# Altium schematic sheet Microcontroler.SchDoc: Soldeerstation
size A4; SheetNumber: 2; SheetTotal: 5
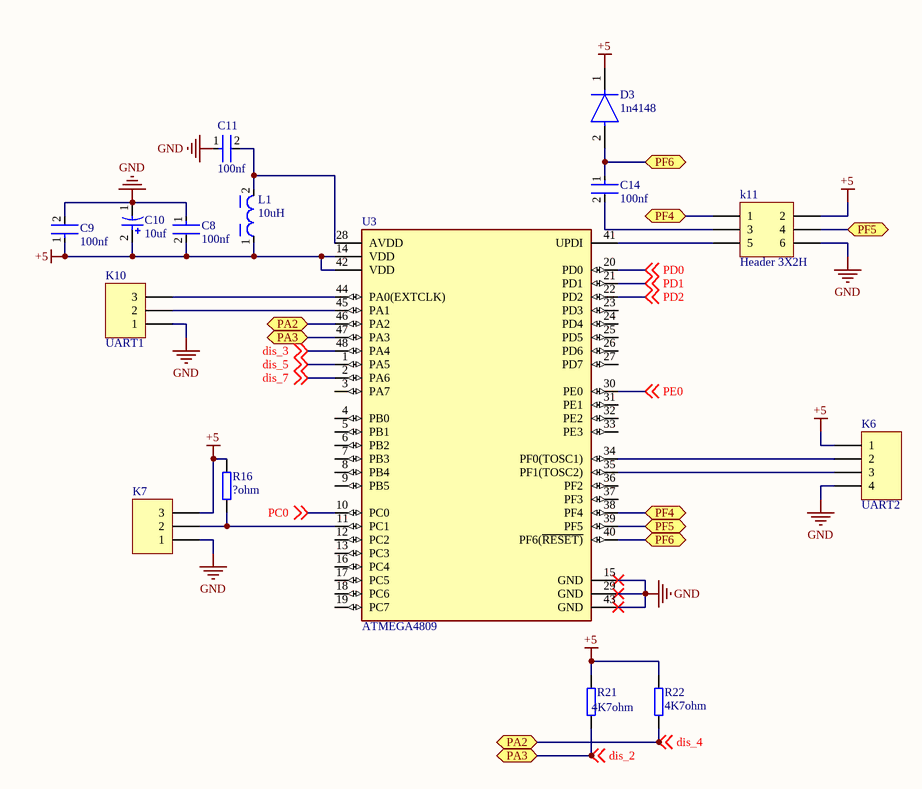
[diagram p0: Microcontroler.SchDoc]

## Parts
C8  100nf  [CC_0805_m]
C9  100nf  [CC_0805_m]
C10  10uf  [CE_D4_L5,4]
C11  100nf  [CC_0805_m]
C14  100nf  [CC_0805_m]
D3  1n4148  [SOD-123FL]
K6  UART2  [MHDR1X4]
K7  Header 3H  [MHDR1X3]  (value not drawn)
K10  UART1  [MHDR1X3]
k11  Header 3X2H  [MHDR2X3]
L1  10uH  [CC_0805_L]
R16  ?ohm  [R_0805_M]
R21  4K7ohm  [R_0805_M]
R22  4K7ohm  [R_0805_M]
U3  ATMEGA4809  [TQFP_48_M]

## Ports
PA2 (bidir), PA3 (bidir), PF4 (bidir), PF5 (bidir), PF6 (bidir)

## Nets
+5: C8.2 C9.1 C10.2 D3.1(C) K6.1 K7.3 k11.2 L1.1 R16.2 R21.2 R22.2 U3.14(VDD) U3.42(VDD)
GND: C8.1 C9.2 C10.1 C11.1 K6.4 K7.1 K10.1 k11.6 U3.15(GND) U3.29(GND) U3.43(GND)
dis_2: R21.1 U3.47(PA3) ; off-sheet dis_2, port PA3
dis_3: U3.48(PA4) ; off-sheet dis_3
dis_4: R22.1 U3.46(PA2) ; off-sheet dis_4, port PA2
dis_5: U3.1(PA5) ; off-sheet dis_5
dis_7: U3.2(PA6) ; off-sheet dis_7
PC0: U3.10(PC0) ; off-sheet PC0
PD0: U3.20(PD0) ; off-sheet PD0
PD1: U3.21(PD1) ; off-sheet PD1
PD2: U3.22(PD2) ; off-sheet PD2
PE0: U3.30(PE0) ; off-sheet PE0
PF4: k11.1 U3.38(PF4) ; port PF4
PF5: k11.4 U3.39(PF5) ; port PF5
PF6: C14.1 D3.2(A) U3.40(PF6(~{RESET)}) ; port PF6
NetC11_2: C11.2 L1.2 U3.28(AVDD)
NetC14_2: C14.2 k11.3
NetK6_2: K6.2 U3.34(PF0(TOSC1))
NetK6_3: K6.3 U3.35(PF1(TOSC2))
NetK7_2: K7.2 R16.1 U3.11(PC1)
NetK10_2: K10.2 U3.45(PA1)
NetK10_3: K10.3 U3.44(PA0(EXTCLK))
Netk11_5: k11.5 U3.41(UPDI)

Not connected (* = marked no-connect by the designer): U3 3(PA7) 4(PB0) 5(PB1) 6(PB2) 7(PB3) 8(PB4) 9(PB5) 12(PC2) 13(PC3) 16(PC4) 17(PC5) 18(PC6) 19(PC7) 23(PD3) 24(PD4) 25(PD5) 26(PD6) 27(PD7) 31(PE1) 32(PE2) 33(PE3) 36(PF2) 37(PF3)

## Library data of the parts
C8 C9 C11 C14 = Capacitor_Ceramic: Manufacturer: KEMET; Manufacturer Part Number: C0805C224K5RACTU; Value: 0.22 μF; Temperature Characteristic: X7R; Temperature Coefficient: 30ppm/°C; Tolerance: 0.1; Voltage Rating: 50 V; ComponentLink2URL: https://content.kemet.com/datasheets/KEM_C1003_C0G_SMD.pdf; Device Class L3: Ceramic Capacitors; Lead Free: Yes; Temperature: -55°C to +125°C; RoHS: TRUE; Capacitance: 0.22 μF; Automotive: No; Material: Ceramic; Octopart: https://octopart.com/c0805c224k5ractu-kemet-144670; Temperature Range Low: -55°C; Height: 0.88mm; Device Class L1: Passive Components; Digikey Description: CAP CER 0.22UF 50V X7R 0805; ComponentLink2Description: Datasheet; Mouser Description: CAP CER 0.22UF 50V X7R 0805; Category: Cap; Ipc Land Pattern Name: CAPC200125X78; Temperature Range High: +125°C; Package: C0805C-DN; Device Class L2: Capacitors
C10 = Capacitor_Electrolytic: Manufacturer: Panasonic; Voltage Rating: 25 V; ComponentLink2URL: http://industrial.panasonic.com/cdbs/www-data/pdf/RDE0000/ABA0000C1181.pdf; Height: 10.2 mm; Max Operating Temperature: 105 degC; PackageReference: EEE-FK1E221P; ComponentLink1Description: Manufacturer URL; ComponentLink1URL: http://www.panasonic.com/; Mount: Surface Mount; REACH SVHC: No SVHC; Min Operating Temperature: -55 degC; ComponentLink2Description: Datasheet; DatasheetVersion: 03/2016; Length: 10.2 mm; RoHSCompliant: true; Packaging: Tape and Reel; Package Quantity: 500; Lead Pitch: 3.1 mm; Pins: 2; PackageDescription: 2-Pin Electrolytic Aluminum Capacitor, Body 8.3 x 8.3 mm; Mounting Technology: Surface Mount
D3 = Diode: Manufacturer Part Number: 1N4007; Manufacturer: Diotec; Max Surge Forward Current: 27A; Forward Current: 1A; Max Junction Temp: +175°C; Reverse Voltage: 1000V; Value: 15pF; Peak Reverse Current: 5uA; Category: Diode; Temperature Range Low: -50°C; Automotive: No; Temperature: -50°C to +175°C; Lead Free: Yes; ComponentLink2Description: Datasheet; Max Repetitive Reverse Voltage: 1000V; ComponentLink2URL: https://datasheet.octopart.com/1N4007-Diotec-datasheet-62346875.pdf; Device Class L3: Rectifier Diodes; Height: 2.8mm; Octopart: https://octopart.com/1n4007-diotec-4040411; Package: 1N4007; Temperature Range High: +175°C; Device Class L1: Discrete Semiconductors; Device Class L2: Diodes; RoHS: TRUE; Capacitance: 15pF; Ipc Land Pattern Name: DIOAD888W100L520D280
K6 = Header 4H: Header, 4-Pin, Right Angle; LatestRevisionDate: 17-Jul-2002; LatestRevisionNote: Re-released for DXP Platform.; Publisher: Altium Limited
K7 K10 = Header 3H: Header, 3-Pin, Right Angle; LatestRevisionDate: 17-Jul-2002; LatestRevisionNote: Re-released for DXP Platform.; Publisher: Altium Limited
k11 = Header 3X2H: Header, 3-Pin, Dual row, Right Angle; LatestRevisionDate: 17-Jul-2002; LatestRevisionNote: Re-released for DXP Platform.; Publisher: Altium Limited
L1 = Choke: Tolerance: 20%; Shielding: Shielded; Saturation Current: 10A; Test Frequency: 100kHz; RMS Current (Irms): 8.5A; Series Resistance: 14.1R; DC Resistance (DCR): 14.1mR; Self Resonant Frequency: 18MHz; Ratings: AEC-Q200; Width: 12.8mm; Series: WE-HCI; Length: 0.512inch; Mount: Surface Mount; Resistor Type: Wirewound; RoHS Compliant: Yes; Inductance: 10uH; Package Quantity: 1; Min Operating Temperature: -40°C; Inductance Tolerance: 20%; Termination: SMD/SMT; Max DC Current: 8.5A; Height - Seated (Max): 0.197inch; Case/Package: 1350; Current Rating: 8.5A; Max Operating Temperature: 155°C; Packaging: Tape and Reel; Height: 4.7mm
R16 R21 R22 = Resistor: Manufacturer: Vishay Dale; Part Number: CRCW08050000Z0EA
U3 = ATMEGA4809: Peripherals: Brown-out Detect/Reset; Number of I/Os: 41; Core Architecture: AVR; Memory Size: 48KB; Interface: I2C; Oscillator Type: Internal; Memory Type: FLASH; Series: megaAVR® 0, Functional Safety (FuSa); Min Operating Temperature: -40°C; Mount: Surface Mount; Case/Package: TQFP; RoHS Compliant: Yes; Max Operating Temperature: 85°C